# Altium schematic sheet Sheet1.SchDoc
size A4
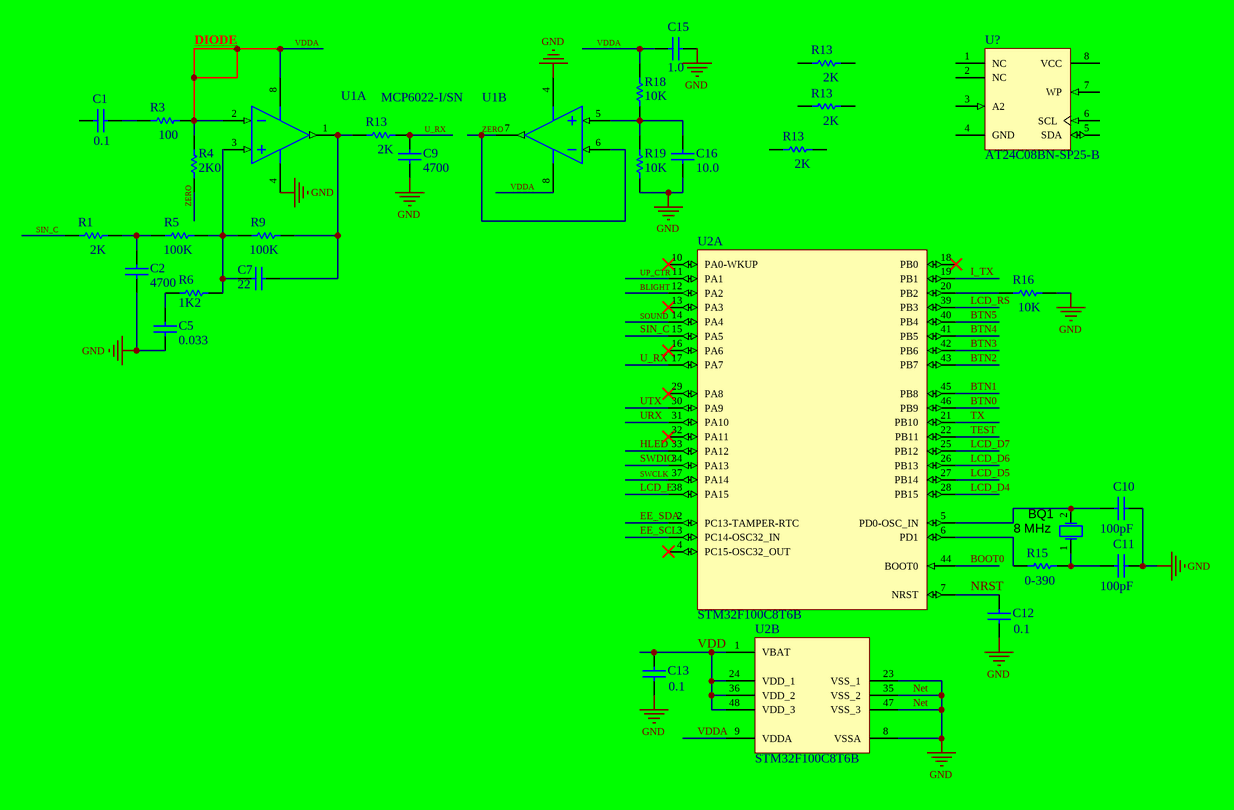
[diagram p0: Sheet1.SchDoc]

## Parts
(Parts that share a designator on the sheet are numbered #1, #2 ... from top to bottom, then left to right.)
BQ1  8 MHz  [HC49SMD]
C1  value 0.1  [1206]  (hidden comment: C1206)
C2  value 4700  [1206]  (hidden comment: C1206)
C5  value 0.033  [1206]  (hidden comment: C1206)
C7  value 22  [1206]  (hidden comment: C1206)
C9  value 4700  [1206]  (hidden comment: C1206)
C10  value 100pF  [1206]  (hidden comment: C1206)
C11  value 100pF  [1206]  (hidden comment: C1206)
C12  value 0.1  [1206]  (hidden comment: C1206)
C13  value 0.1  [1206]  (hidden comment: C1206)
C15  value 1.0  [1206]  (hidden comment: C1206)
C16  value 10.0  [1206]  (hidden comment: C1206)
R1  value 2K  [8-1206]  (hidden comment: ERJ8EN)
R3  value 100  [8-1206]  (hidden comment: ERJ8EN)
R4  value 2K0  [8-1206]  (hidden comment: ERJ8EN)
R5  value 100K  [8-1206]  (hidden comment: ERJ8EN)
R6  value 1K2  [8-1206]  (hidden comment: ERJ8EN)
R9  value 100K  [8-1206]  (hidden comment: ERJ8EN)
R13#1  value 2K  [8-1206]  (hidden comment: ERJ8EN)
R13#2  value 2K  [8-1206]  (hidden comment: ERJ8EN)
R13#3  value 2K  [8-1206]  (hidden comment: ERJ8EN)
R13#4  value 2K  [8-1206]  (hidden comment: ERJ8EN)
R15  value 0-390  [8-1206]  (hidden comment: ERJ8EN)
R16  value 10K  [8-1206]  (hidden comment: ERJ8EN)
R18  value 10K  [8-1206]  (hidden comment: ERJ8EN)
R19  value 10K  [8-1206]  (hidden comment: ERJ8EN)
U1  MCP6022-I/SN  [SOIC-SN8_N]  (parts A,B of 2)
U2  STM32F100C8T6B  [LQFP48_N]  (parts A,B of 2)
U?  AT24C08BN-SP25-B  [8S1_N]

## Nets
Net: C2.2 C5.1 C9.2 C10.2 C11.2 C12.1 C13.1 C15.2 C16.2 R16.2 R19.1 U1.4(VSS) U2.8(VSSA) U2.23(VSS_1) U2.35(VSS_2) U2.47(VSS_3)  [also labelled GND]
BLIGHT: U2.12(PA2)
BOOT0: U2.44(BOOT0)
BTN0: U2.46(PB9)
BTN1: U2.45(PB8)
BTN2: U2.43(PB7)
BTN3: U2.42(PB6)
BTN4: U2.41(PB5)
BTN5: U2.40(PB4)
EE_SCL: U2.3(PC14-OSC32_IN)
EE_SDA: U2.2(PC13-TAMPER-RTC)
HLED: U2.33(PA12)
I_TX: U2.19(PB1)
LCD_D4: U2.28(PB15)
LCD_D5: U2.27(PB14)
LCD_D6: U2.26(PB13)
LCD_D7: U2.25(PB12)
LCD_E: U2.38(PA15)
LCD_RS: U2.39(PB3)
NRST: C12.2 U2.7(NRST)
SIN_C: R1.1 U2.15(PA5)
SOUND: U2.14(PA4)
SWCLK: U2.37(PA14)
SWDIO: U2.34(PA13)
TEST: U2.22(PB11)
TX: U2.21(PB10)
U_RX: C9.1 R13#3.2 U2.17(PA7)
UP_CTR: U2.11(PA1)
URX: U2.31(PA10)
UTX: U2.30(PA9)
VDD: C13.2 U2.1(VBAT) U2.24(VDD_1) U2.36(VDD_2) U2.48(VDD_3)
VDDA: C15.1 R3.2 R4.2 R18.2 U1.2(VINA-) U1.8(VDD) U2.9(VDDA)
ZERO: R4.1 U1.6(VINB-) U1.7(VOUTB)
NetBQ1_1: BQ1.1(OSC1) C11.1 R15.2
NetBQ1_2: BQ1.2(OSC2) C10.1 U2.5(PD0-OSC_IN)
NetC1_2: C1.2 R3.1
NetC2_1: C2.1 R1.2 R5.1
NetC5_2: C5.2 R6.2
NetC7_1: C7.1 R5.2 R6.1 R9.1 U1.3(VINA+)
NetC7_2: C7.2 R9.2 R13#3.1 U1.1(VOUTA)
NetC16_1: C16.1 R18.1 R19.2 U1.5(VINB+)
NetR15_1: R15.1 U2.6(PD1)
NetR16_1: R16.1 U2.20(PB2)

Not connected (* = marked no-connect by the designer): C1 1; R13#1 1 2; R13#2 1 2; R13#4 1 2; U2 4(PC15-OSC32_OUT)* 10(PA0-WKUP)* 13(PA3)* 16(PA6)* 18(PB0)* 29(PA8)* 32(PA11)*; U? 1(NC) 2(NC) 3(A2) 4(GND) 5(SDA) 6(SCL) 7(WP) 8(VCC)

## Notes on the sheet
- DIODE

## Library data of the parts
BQ1 = XTAL: Crystal Oscillator; Published: 8-Jun-2000; LatestRevisionDate: 17-Jul-2002; LatestRevisionNote: Re-released for DXP Platform.; PackageReference: R38; Publisher: Altium Limited
C1 C2 C5 C7 C9-C13 C15 C16 = C1206: Ceramic Chip Capacitor - Standard; Published: 17-Jul-2002; LatestRevisionDate: 19-Mar-2004; LatestRevisionNote: Silkscreen size reduced.; DatasheetDocument: Mar-2001; PackageDocument: Mar-2001; PackageReference: 1206; Publisher: Altium Limited; Code_JEITA: 1206; Code_IPC: 3216 [1206]; ComponentLink1Description: Manufacturer Link; ComponentLink1URL: http://www.kemet.com/; ComponentLink2Description: Datasheet; ComponentLink2URL: http://www.kemet.com/kemet/web/homepage/kechome.nsf/vapubfilesname/F3102TA.pdf/$file/F3102TA.pdf
R1 R3-R6 R9 R13#1-R13#4 R15 R16 R18 R19 = ERJ8EN: Precision Thick Film Chip Resistor, 10 Ohm to 2.2M Ohm Range, 1% Tolerance, 1206 Size, 0.125 W; Published: 17-Dec-2003; LatestRevisionDate: 19-Mar-2004; LatestRevisionNote: Silkscreen size reduced.; PackageDocument: Mar-2003; PackageReference: 8-1206; Publisher: Altium Limited; Code_IPC: 3216 [1206]; ComponentLink1Description: Manufacturer Link; ComponentLink1URL: http://www.panasonic.com/industrial/components/resistive_products.htm; ComponentLink2Description: Datasheet; ComponentLink2URL: http://www.panasonic.com/industrial/components/pdf/AOA0000CE2.pdf
U1 = MCP6022-I/SN: Rail-to-Rail Input/Output, 10 MHz Operational Amplifier, 8-Pin SOIC, Industrial Temperature; Published: 29-Jan-2009; LatestRevisionDate: 02-Dec-2009; LatestRevisionNote: Updated to datasheet revision D, Feb-2009; DatasheetVersion: revD, Feb-2009; PackageVersion: revBB, Aug-2009; PackageReference: SOIC-SN8; Publisher: Altium Limited; PackageDescription: 8-Lead Plastic Small Outline (SN) - Narrow, 3.90mm Body [SOIC]; Supplier 1: Digi-Key; Supplier Part Number 1: MCP6022-I/SN-ND; Supplier 2: Farnell; Supplier Part Number 2: 1439415; Code_JEDEC: MS-012; Code_IPC: SOIC127P600-8; ComponentLink1Description: Datasheet; ComponentLink1URL: http://ww1.microchip.com/downloads/en/DeviceDoc/21685d.pdf; ComponentLink2Description: Packaging Specification; ComponentLink2URL: http://www.microchip.com/stellent/groups/techpub_sg/documents/packagingspec/en012702.pdf; ComponentLink3Description: Microchip.com Home; ComponentLink3URL: http://www.microchip.com/
U2 = STM32F100C8T6B: STM32 ARM-based 32-bit MCU Value Line with 64 kB Flash, 8 kB Internal RAM, Internal Code B, -40 to +85°C Temperature, 48-Pin LQFP, Tray; DatasheetVersion: rev6.0, Apr-2011; PackageVersion: rev13, Apr-2011; PackageReference: LQFP48; PackageDescription: 48-Pin Low-Profile Quad Flat Pack, 7 x 7 mm Body, 0.5 mm Pitch (LQFP48); ComponentLink1Description: Manufacturer URL; ComponentLink1URL: http://www.st.com/; ComponentLink2Description: STM32F100 Datasheet; ComponentLink2URL: http://www.st.com/internet/com/TECHNICAL_RESOURCES/TECHNICAL_LITERATURE/DATASHEET/CD00251732.pdf; ComponentLink3Description: STM32 Family Web Page; ComponentLink3URL: www.st.com/stm32
U? = AT24C08BN-SP25-B: 8Kbit (1024 x 8), 2-wire Bus Automotive Serial EEPROM with Write Protect, 2.5V, 8-Pin SOIC, Bulk; Published: 20-Sep-2010; DatasheetVersion: 8517C,  Jan-2009; PackageVersion: revC, Mar-2005; PackageReference: 8S1; Publisher: Altium Limited; PackageDescription: 8-Lead (0.150" Wide Body), Plastic Gull Wing Small Outline (JEDEC SOIC); Code_JEDEC: MS-012-AA; Code_IPC: SOIC127P600-8; ComponentLink1Description: Manufacturer Link; ComponentLink1URL: http://www.atmel.com/products/serial/default.asp; ComponentLink2Description: Datasheet; ComponentLink2URL: http://www.atmel.com/dyn/resources/prod_documents/doc8517.pdf; ComponentLink3Description: Atmel.com Home; ComponentLink3URL: http://www.atmel.com